# EasyEDA Pro project ProPrj_F080104_2024-08-08.epro

# Schematic Schematic1
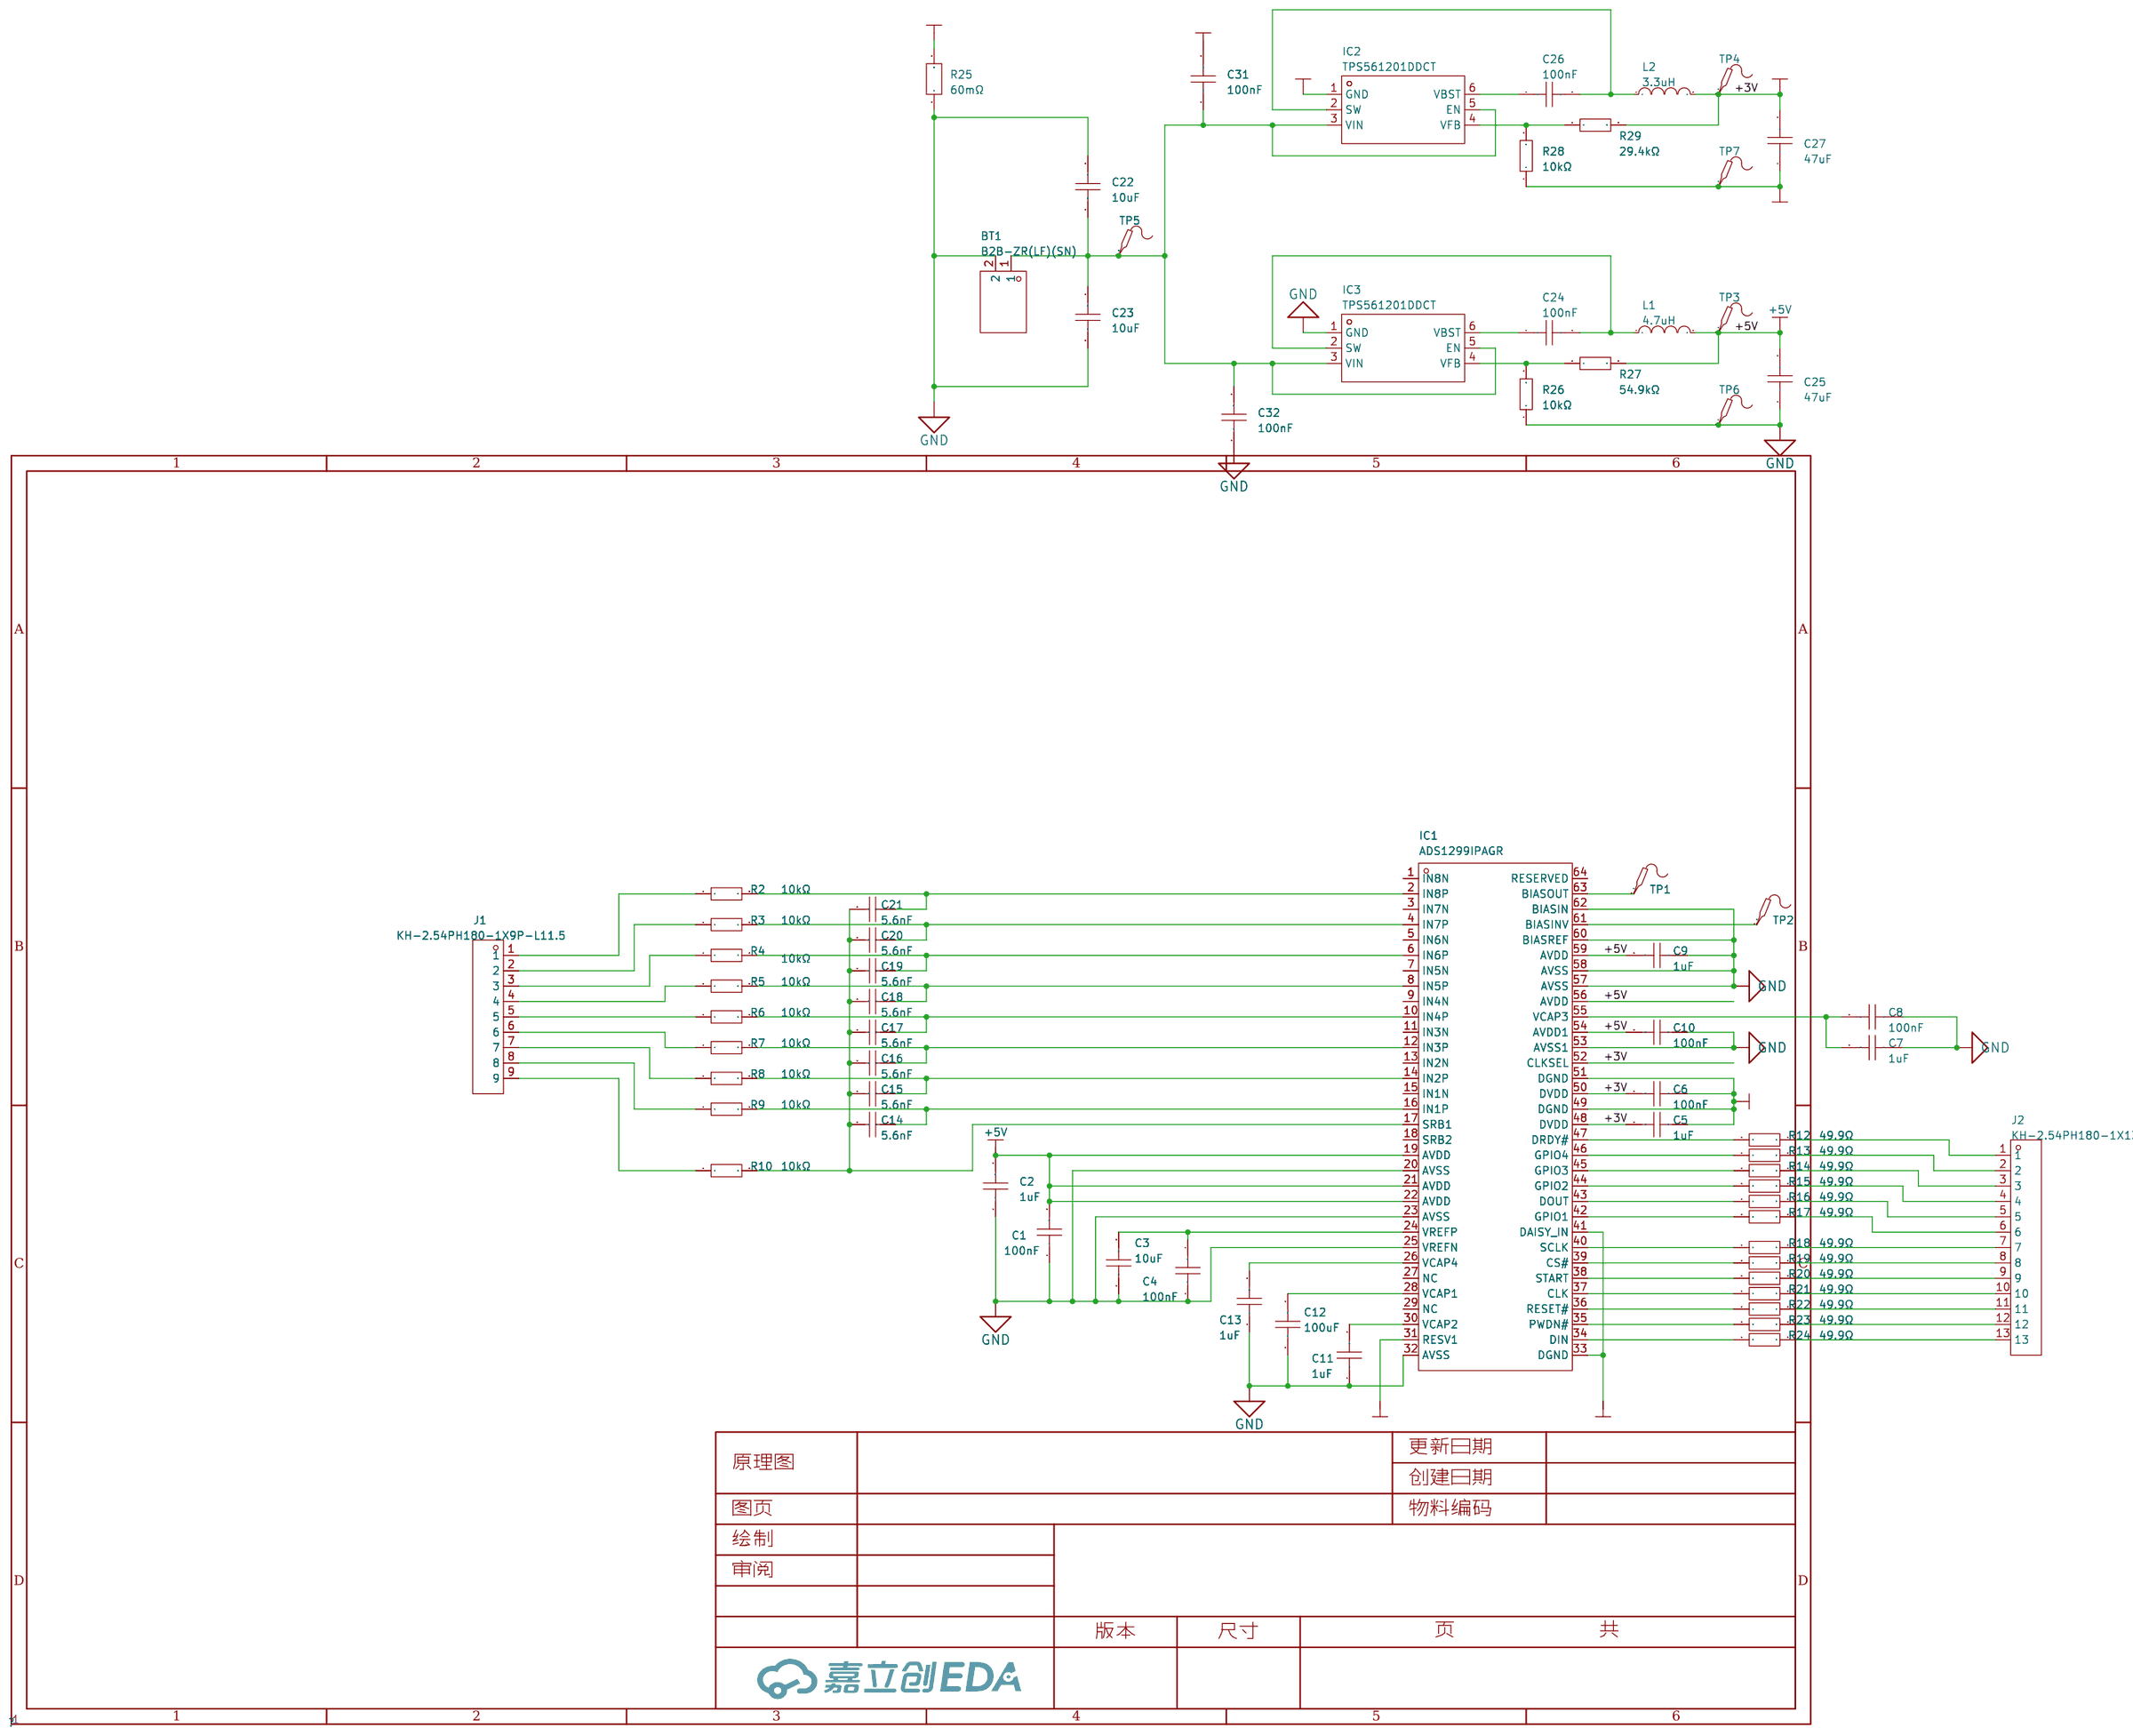
[diagram p0: schematic sheet]

## Parts
BT1  B2B-ZR(LF)(SN)  [CONN-TH_B2B-ZR-LF-SN]
C1  100nF  [C0603]
C2  1uF  [C0603]
C3  10uF  [C0805]
C4  100nF  [C0603]
C5  1uF  [C0603]
C6  100nF  [C0603]
C7  1uF  [C0603]
C8  100nF  [C0603]
C9  1uF  [C0603]
C10  100nF  [C0603]
C11  1uF  [C0603]
C12  100uF  [C1206]
C13  1uF  [C0603]
C14  5.6nF  [C0603]
C15  5.6nF  [C0603]
C16  5.6nF  [C0603]
C17  5.6nF  [C0603]
C18  5.6nF  [C0603]
C19  5.6nF  [C0603]
C20  5.6nF  [C0603]
C21  5.6nF  [C0603]
C22  10uF  [C0805]
C23  10uF  [C0805]
C24  100nF  [C0603]
C25  47uF  [C0805]
C26  100nF  [C0603]
C27  47uF  [C0805]
C31  100nF  [C0603]
C32  100nF  [C0603]
IC1  ADS1299IPAGR  [TQFP-64_L10.0-W10.0-P0.50-LS12.0-TL]
IC2  TPS561201DDCT  [SOT-23-6_L2.9-W1.6-P0.95-LS2.8-BR]
IC3  TPS561201DDCT  [SOT-23-6_L2.9-W1.6-P0.95-LS2.8-BR]
J1  KH-2.54PH180-1X9P-L11.5  [HDR-TH_9P-P2.54-V-M]
J2  KH-2.54PH180-1X13P-L11.5  [HDR-TH_13P-P2.54-V-M]
L1  4.7uH  [IND-SMD_L4.4-W4.2]
L2  3.3uH  [IND-SMD_L4.4-W4.2-A]
R2  10kΩ  [R0603]
R3  10kΩ  [R0603]
R4  10kΩ  [R0603]
R5  10kΩ  [R0603]
R6  10kΩ  [R0603]
R7  10kΩ  [R0603]
R8  10kΩ  [R0603]
R9  10kΩ  [R0603]
R10  10kΩ  [R0603]
R12  49.9Ω  [R0603]
R13  49.9Ω  [R0603]
R14  49.9Ω  [R0603]
R15  49.9Ω  [R0603]
R16  49.9Ω  [R0603]
R17  49.9Ω  [R0603]
R18  49.9Ω  [R0603]
R19  49.9Ω  [R0603]
R20  49.9Ω  [R0603]
R21  49.9Ω  [R0603]
R22  49.9Ω  [R0603]
R23  49.9Ω  [R0603]
R24  49.9Ω  [R0603]
R25  60mΩ  [R2512]
R26  10kΩ  [R0603]
R27  54.9kΩ  [R0603]
R28  10kΩ  [R0603]
R29  29.4kΩ  [R0603]
TP1  -  [Test-Point-0.5mm]
TP2  -  [Test-Point-0.5mm]
TP3  -  [Test-Point-0.5mm]
TP4  -  [Test-Point-0.5mm]
TP5  -  [Test-Point-0.5mm]
TP6  -  [Test-Point-0.5mm]
TP7  -  [Test-Point-0.5mm]

## Library data of the parts
BT1 = B2B-ZR(LF)(SN): 插针结构:1x2P;间距:1.5mm;安装方式:直插;参考系列:ZH;总PIN数:2P;排数:1;每排PIN数:2;行距:-;额定电流:1A;触头材质:黄铜;触头镀层:锡;工作温度范围:-25℃~+85℃;; LCSC Part Name: 1x2P 间距:1.5mm 直插 系列:ZH; Supplier Part: C158011; Manufacturer: JST; Supplier Footprint: 插件,P=1.5mm; JLCPCB Part Class: 扩展库; Datasheet: https://atta.szlcsc.com/upload/public/pdf/source/20181223/C158011_6CFD0C70F58E1854900B8AF425FE5444.pdf; Supplier: LCSC; Pins Structure: 1x2P; Pitch: 1.5mm; Mounting Style: 直插; Reference Series: ZH; Number of Pins: 2P; Number of Rows: 1; Number of PINs Per Row: 2; Current Rating (Max): 1A; Contact Material: 黄铜; Contact Plating: 锡; Operating Temperature Range: -25℃~+85℃; Rated Voltage (Max): 50V; Plastic Material: 玻纤增强PA66; Flame Retardant Rating: UL94V-0; Colour: 白色; Z-Height of the Board: 4.5mm; X-Length of Bottom Edge on Board (Spacing Line): 4.5mm; Y-Width of Bottom Edge on Board: 3.5mm
C1 C4 C6 C8 C10 C24 C26 C31 C32 = CC0603KRX7R9BB104: 容值:100nF;精度:±10%;额定电压:50V;材质(温度系数):X7R;; LCSC Part Name: 100nF ±10% 50V; Supplier Part: C14663; Manufacturer: YAGEO(国巨); Supplier Footprint: 0603; JLCPCB Part Class: 基础库; Datasheet: https://atta.szlcsc.com/upload/public/pdf/source/20180910/C282072_33301C7F631E79921B82A8DAC6BCC5B3.pdf; Supplier: LCSC; Tolerance: ±10%; Voltage Rated: 50V; Temperature Coefficient: X7R
C2 C5 C7 C9 C11 C13 = CL10A105KB8NNNC: 容值:1uF;精度:±10%;额定电压:50V;材质(温度系数):X5R;; LCSC Part Name: 1uF ±10% 50V; Supplier Part: C15849; Manufacturer: SAMSUNG(三星); Supplier Footprint: 0603; JLCPCB Part Class: 基础库; Datasheet: https://atta.szlcsc.com/upload/public/pdf/source/20160218/1457707763339.pdf; Supplier: LCSC; Tolerance: ±10%; Voltage Rated: 50V; Temperature Coefficient: X5R
C3 C22 C23 = CL21A106KAYNNNE_C15850: 容值:10uF;精度:±10%;额定电压:25V;材质(温度系数):X5R;; LCSC Part Name: 10uF ±10% 25V; Supplier Part: C15850; Manufacturer: SAMSUNG(三星); Manufacturer Part: CL21A106KAYNNNE; Supplier Footprint: 0805; JLCPCB Part Class: 基础库; Datasheet: https://atta.szlcsc.com/upload/public/pdf/source/20160218/1457707763339.pdf; Supplier: LCSC; Tolerance: ±10%; Voltage Rated: 25V; Temperature Coefficient: X5R
C12 = GRM31CR61A107ME05L: 容值:100uF;精度:±20%;额定电压:10V;材质(温度系数):X5R;; LCSC Part Name: 100uF ±20% 10V; Supplier Part: C312983; Manufacturer: muRata(村田); Supplier Footprint: 1206; JLCPCB Part Class: 扩展库; Datasheet: https://atta.szlcsc.com/upload/public/pdf/source/20181029/C312983_F99DFC7E8AF2C04CC95A01A8A93C8DA6.pdf; Supplier: LCSC; Tolerance: ±20%; Voltage Rated: 10V; Temperature Coefficient: X5R
C14-C21 = CC0603KRX7R9BB562: 容值:5.6nF;精度:±10%;额定电压:50V;材质(温度系数):X7R;; LCSC Part Name: 5.6nF ±10% 50V; Supplier Part: C107095; Manufacturer: YAGEO(国巨); Supplier Footprint: 0603; JLCPCB Part Class: Extended Part; Datasheet: https://atta.szlcsc.com/upload/public/pdf/source/20180910/C282072_33301C7F631E79921B82A8DAC6BCC5B3.pdf; Supplier: LCSC; Tolerance: ±10%; Voltage Rated: 50V; Temperature Coefficient: X7R
C25 C27 = GRM21BR61A476ME15L: 容值:47uF;精度:±20%;额定电压:10V;材质(温度系数):X5R;; LCSC Part Name: 47uF ±20% 10V; Supplier Part: C124129; Manufacturer: muRata(村田); Supplier Footprint: 0805; JLCPCB Part Class: 扩展库; Datasheet: https://atta.szlcsc.com/upload/public/pdf/source/20190505/C124129_B8538B07430F41D0B450AD3CB0CEE103.pdf; Supplier: LCSC; Tolerance: ±20%; Voltage Rated: 10V; Temperature Coefficient: X5R
IC1 = ADS1299IPAGR: 电源电压:5V；1.8V~3.6V;; Supplier Part: C476817; Manufacturer: TI(德州仪器); Supplier Footprint: TQFP-64(10x10); JLCPCB Part Class: 扩展库; Datasheet: https://www.ti.com/cn/lit/gpn/ads1299; Supplier: LCSC; Supply Voltage: 5V；1.8V~3.6V
IC2 IC3 = TPS561201DDCT: 功能类型:降压型;输出类型:可调;输入电压:4.5V~17V;输出电压:760mV~7V;输出电流(最大值):1A;; Supplier Part: C133965; Manufacturer: TI(德州仪器); Supplier Footprint: SOT-23-6; JLCPCB Part Class: 扩展库; Datasheet: https://www.ti.com/cn/lit/gpn/tps561201; Supplier: LCSC; Function: 降压型; Output Type: 可调; Input Voltage: 4.5V~17V; Output Voltage: 760mV~7V; Output Current (Max): 1A; Switching Frequency: 580kHz; Operating Temperature: -40℃~+85℃@(TA); Synchronous Rectification: 是; Number of Outputs: 1; Topology: 降压式; Switch tube (built-in/external): 内置
J1 = KH-2.54PH180-1X9P-L11.5: 插针结构:1x9P;间距:2.54mm;行距:-;圆针/方针:方针;安装类型:直插;排数:单排;总PIN位数:9P;额定电流:3A;额定电压:-;配合针长度:6mm;塑高:2.5mm;端接针长度:3mm;工作温度范围:-40℃~+105℃;颜色:黑色;; LCSC Part Name: 间距:2.54mm 1x9P 直插 方针; Supplier Part: C2932701; Manufacturer: kinghelm(金航标); Supplier Footprint: 插件,P=2.54mm; JLCPCB Part Class: 扩展库; Datasheet: https://atta.szlcsc.com/upload/public/pdf/source/20211220/F957F65180C658B5F5CB9573E63AB667.pdf; Supplier: LCSC; Pin Structure: 1x9P; Pitch: 2.54mm; Circluar Pins/Square Pins: 方针; Mounting Type: 直插; Number of Rows: 单排; Number of Pins: 9P; Current Rating (Max): 3A; Length of Mating Pin: 6mm; Insulation Height: 2.5mm; Length of End Connection Pin: 3mm; Operating Temperature Range: -40℃~+105℃; Color: 黑色
J2 = KH-2.54PH180-1X13P-L11.5: 插针结构:1x13P;间距:2.54mm;行距:-;圆针/方针:方针;安装类型:直插;排数:单排;总PIN位数:13P;额定电流:3A;额定电压:-;配合针长度:6mm;塑高:2.5mm;端接针长度:3mm;工作温度范围:-40℃~+105℃;颜色:黑色;; LCSC Part Name: 间距:2.54mm 1x13P 直插 方针; Supplier Part: C2932703; Manufacturer: kinghelm(金航标); Supplier Footprint: 插件,P=2.54mm; JLCPCB Part Class: 扩展库; Datasheet: https://atta.szlcsc.com/upload/public/pdf/source/20211220/1D630C15EFD28F2B017872C11B9B32F4.pdf; Supplier: LCSC; Pin Structure: 1x13P; Pitch: 2.54mm; Circluar Pins/Square Pins: 方针; Mounting Type: 直插; Number of Rows: 单排; Number of Pins: 13P; Current Rating (Max): 3A; Length of Mating Pin: 6mm; Insulation Height: 2.5mm; Length of End Connection Pin: 3mm; Operating Temperature Range: -40℃~+105℃; Color: 黑色
L1 = FXL0420-4R7-M: 电感值:4.7uH;精度:±20%;额定电流:2.8A;饱和电流(Isat):3A;类型:一体成型电感;; LCSC Part Name: 4.7uH ±20% 3A; Supplier Part: C167208; Manufacturer: cjiang(长江微电); Supplier Footprint: SMD,4.2x4.4mm; JLCPCB Part Class: 扩展库; Datasheet: https://atta.szlcsc.com/upload/public/pdf/source/20240426/3189EA8206330E2108542F9E34E540E7.pdf; Supplier: LCSC; Tolerance: ±20%; Rated Current: 2.8A; Saturation Current (Isat): 3A; DC Resistance (DCR): 105mΩ; Type: 一体成型电感
L2 = FXL0420-3R3-M: 电感值:3.3uH;精度:±20%;额定电流:3.3A;饱和电流(Isat):4A;类型:一体成型电感;; LCSC Part Name: 3.3uH ±20% 4A; Supplier Part: C167207; Manufacturer: cjiang(长江微电); Supplier Footprint: SMD,4.2x4.4mm; JLCPCB Part Class: 扩展库; Datasheet: https://atta.szlcsc.com/upload/public/pdf/source/20240426/3189EA8206330E2108542F9E34E540E7.pdf; Supplier: LCSC; Tolerance: ±20%; Rated Current: 3.3A; Saturation Current (Isat): 4A; DC Resistance (DCR): 87mΩ; Type: 一体成型电感
R2-R10 R26 R28 = 0603WAF1002T5E: 电阻类型:厚膜电阻;阻值:10kΩ;精度:±1%;功率:100mW;最大工作电压:75V;温度系数:±100ppm/℃;; LCSC Part Name: 厚膜电阻 10kΩ ±1% 100mW; Supplier Part: C25804; Manufacturer: UNI-ROYAL(厚声); Supplier Footprint: 0603; JLCPCB Part Class: 基础库; Datasheet: https://atta.szlcsc.com/upload/public/pdf/source/20200306/C422600_1E6D84923E4A46A82E41ADD87F860B5C.pdf; Supplier: LCSC; Type: 厚膜电阻; Tolerance: ±1%; Power(Watts): 100mW; Overload Voltage (Max): 75V; Temperature Coefficient: ±100ppm/℃; Operating Temperature Range: -55℃~+155℃
R12-R24 = 0603WAF499JT5E: 电阻类型:厚膜电阻;阻值:49.9Ω;精度:±1%;功率:100mW;最大工作电压:75V;温度系数:±100ppm/℃;; LCSC Part Name: 49.9Ω ±1% 100mW 厚膜电阻; Supplier Part: C23185; Manufacturer: UNI-ROYAL(厚声); Supplier Footprint: 0603; JLCPCB Part Class: Basic Part; Datasheet: https://atta.szlcsc.com/upload/public/pdf/source/20200306/C422600_1E6D84923E4A46A82E41ADD87F860B5C.pdf; Supplier: LCSC; Type: 厚膜电阻; Tolerance: ±1%; Power(Watts): 100mW; Overload Voltage (Max): 75V; Temperature Coefficient: ±100ppm/℃; Operating Temperature Range: -55℃~+155℃
R25 = 25121WF600MT4E: 电阻类型:厚膜电阻;阻值:60mΩ;精度:±1%;功率:1W;最大工作电压:200V;温度系数:±800ppm/℃;; LCSC Part Name: 60mΩ ±1% 1W 厚膜电阻; Supplier Part: C421528; Manufacturer: UNI-ROYAL(厚声); Supplier Footprint: 2512; JLCPCB Part Class: 扩展库; Datasheet: https://atta.szlcsc.com/upload/public/pdf/source/20200306/C422600_1E6D84923E4A46A82E41ADD87F860B5C.pdf; Supplier: LCSC; Type: 厚膜电阻; Tolerance: ±1%; Power(Watts): 1W; Overload Voltage (Max): 200V; Temperature Coefficient: ±800ppm/℃; Operating Temperature Range: -55℃~+155℃
R27 = 0603WAF5492T5E: 电阻类型:厚膜电阻;阻值:54.9kΩ;精度:±1%;功率:100mW;最大工作电压:75V;温度系数:±100ppm/℃;; LCSC Part Name: 54.9kΩ ±1% 100mW 厚膜电阻; Supplier Part: C23077; Manufacturer: UNI-ROYAL(厚声); Supplier Footprint: 0603; JLCPCB Part Class: 扩展库; Datasheet: https://atta.szlcsc.com/upload/public/pdf/source/20200306/C422600_1E6D84923E4A46A82E41ADD87F860B5C.pdf; Supplier: LCSC; Type: 厚膜电阻; Tolerance: ±1%; Power(Watts): 100mW; Overload Voltage (Max): 75V; Temperature Coefficient: ±100ppm/℃; Operating Temperature Range: -55℃~+155℃
R29 = 0603WAF2942T5E: 电阻类型:厚膜电阻;阻值:29.4kΩ;精度:±1%;功率:100mW;最大工作电压:75V;温度系数:±100ppm/℃;; LCSC Part Name: 29.4kΩ ±1% 100mW 厚膜电阻; Supplier Part: C22974; Manufacturer: UNI-ROYAL(厚声); Supplier Footprint: 0603; JLCPCB Part Class: 扩展库; Datasheet: https://atta.szlcsc.com/upload/public/pdf/source/20200306/C422600_1E6D84923E4A46A82E41ADD87F860B5C.pdf; Supplier: LCSC; Type: 厚膜电阻; Tolerance: ±1%; Power(Watts): 100mW; Overload Voltage (Max): 75V; Temperature Coefficient: ±100ppm/℃; Operating Temperature Range: -55℃~+155℃
TP1-TP7 = Test-Point: Test Point 测试点

## Nets
+3V: C5.2 C6.2 C27.2 IC1.48(DVDD) IC1.50(DVDD) IC1.52(CLKSEL) L2.2 R29.2 TP4.1
+5V: C1.2 C2.2 C9.2 C10.2 C25.2 IC1.19(AVDD) IC1.21(AVDD) IC1.22(AVDD) IC1.54(AVDD1) IC1.56(AVDD) IC1.59(AVDD) L1.2 R27.2 TP3.1
GND: BT1.2 C1.1 C2.1 C3.1 C4.2 C7.1 C8.1 C9.1 C10.1 C11.1 C12.2 C13.1 C22.2 C23.2 C25.1 C32.1 IC1.20(AVSS) IC1.23(AVSS) IC1.25(VREFN) IC1.32(AVSS) IC1.53(AVSS1) IC1.57(AVSS) IC1.58(AVSS) IC1.60(BIASREF) IC1.62(BIASIN) IC3.1(GND) R25.1 R26.1 TP6.1
GNDD: C5.1 C6.1 C27.1 C31.2 IC1.31(RESV1) IC1.33(DGND) IC1.41(DAISY_IN) IC1.49(DGND) IC1.51(DGND) IC2.1(GND) R25.2 R28.1 TP7.1
$1N2055: C21.1 IC1.2(IN8P) R2.2
$1N2059: C20.1 IC1.4(IN7P) R3.2
$1N2064: C19.1 IC1.6(IN6P) R4.2
$1N2069: C18.1 IC1.8(IN5P) R5.2
$1N2074: C17.1 IC1.10(IN4P) R6.2
$1N2079: C16.1 IC1.12(IN3P) R7.2
$1N2084: C15.1 IC1.14(IN2P) R8.2
$1N2089: C14.1 IC1.16(IN1P) R9.2
$1N2097: C14.2 C15.2 C16.2 C17.2 C18.2 C19.2 C20.2 C21.2 IC1.17(SRB1) R10.2
$1N2947: BT1.1 C22.1 C23.1 C31.1 C32.2 IC2.3(VIN) IC2.5(EN) IC3.3(VIN) IC3.5(EN) TP5.1
$1N3234: C26.2 IC2.2(SW) L2.1
$1N3242: C26.1 IC2.6(VBST)
$1N3333: C24.2 IC3.2(SW) L1.1
$1N3336: C24.1 IC3.6(VBST)
$1N3595: IC2.4(VFB) R28.2 R29.1
$1N4010: IC3.4(VFB) R26.2 R27.1
$1N4304: J1.1 R2.1
$1N4313: J1.2 R3.1
$1N4321: J1.3 R4.1
$1N4328: J1.4 R5.1
$1N4338: J1.5 R6.1
$1N4345: J1.6 R7.1
$1N4350: J1.7 R8.1
$1N4357: J1.8 R9.1
$1N4364: J1.9 R10.1
$1N4747: C3.2 C4.1 IC1.24(VREFP)
$1N5094: C11.2 IC1.30(VCAP2)
$1N5099: C12.1 IC1.28(VCAP1)
$1N5104: C13.2 IC1.26(VCAP4)
$1N5770: IC1.47(DRDY#) R12.1
$1N5774: IC1.46(GPIO4) R13.1
$1N5779: IC1.45(GPIO3) R14.1
$1N5784: IC1.44(GPIO2) R15.1
$1N5789: IC1.43(DOUT) R16.1
$1N5794: IC1.42(GPIO1) R17.1
$1N5799: IC1.40(SCLK) R18.1
$1N5804: IC1.39(CS#) R19.1
$1N5809: IC1.38(START) R20.1
$1N5814: IC1.37(CLK) R21.1
$1N5819: IC1.36(RESET#) R22.1
$1N5824: IC1.35(PWDN#) R23.1
$1N5829: IC1.34(DIN) R24.1
$1N6093: J2.13 R24.2
$1N6097: J2.12 R23.2
$1N6102: J2.11 R22.2
$1N6107: J2.10 R21.2
$1N6112: J2.9 R20.2
$1N6117: J2.8 R19.2
$1N6122: J2.7 R18.2
$1N6127: J2.6 R17.2
$1N6137: J2.5 R16.2
$1N6143: J2.4 R15.2
$1N6150: J2.3 R14.2
$1N6157: J2.2 R13.2
$1N6164: J2.1 R12.2
$1N6494: C7.2 C8.2 IC1.55(VCAP3)
$1N9345: IC1.63(BIASOUT) TP1.1
$1N9349: IC1.61(BIASINV) TP2.1

Not connected (* = marked no-connect by the designer): IC1 1(IN8N) 3(IN7N) 5(IN6N) 7(IN5N) 9(IN4N) 11(IN3N) 13(IN2N) 15(IN1N) 18(SRB2) 27(NC) 29(NC) 64(RESERVED)

# Board PCB1
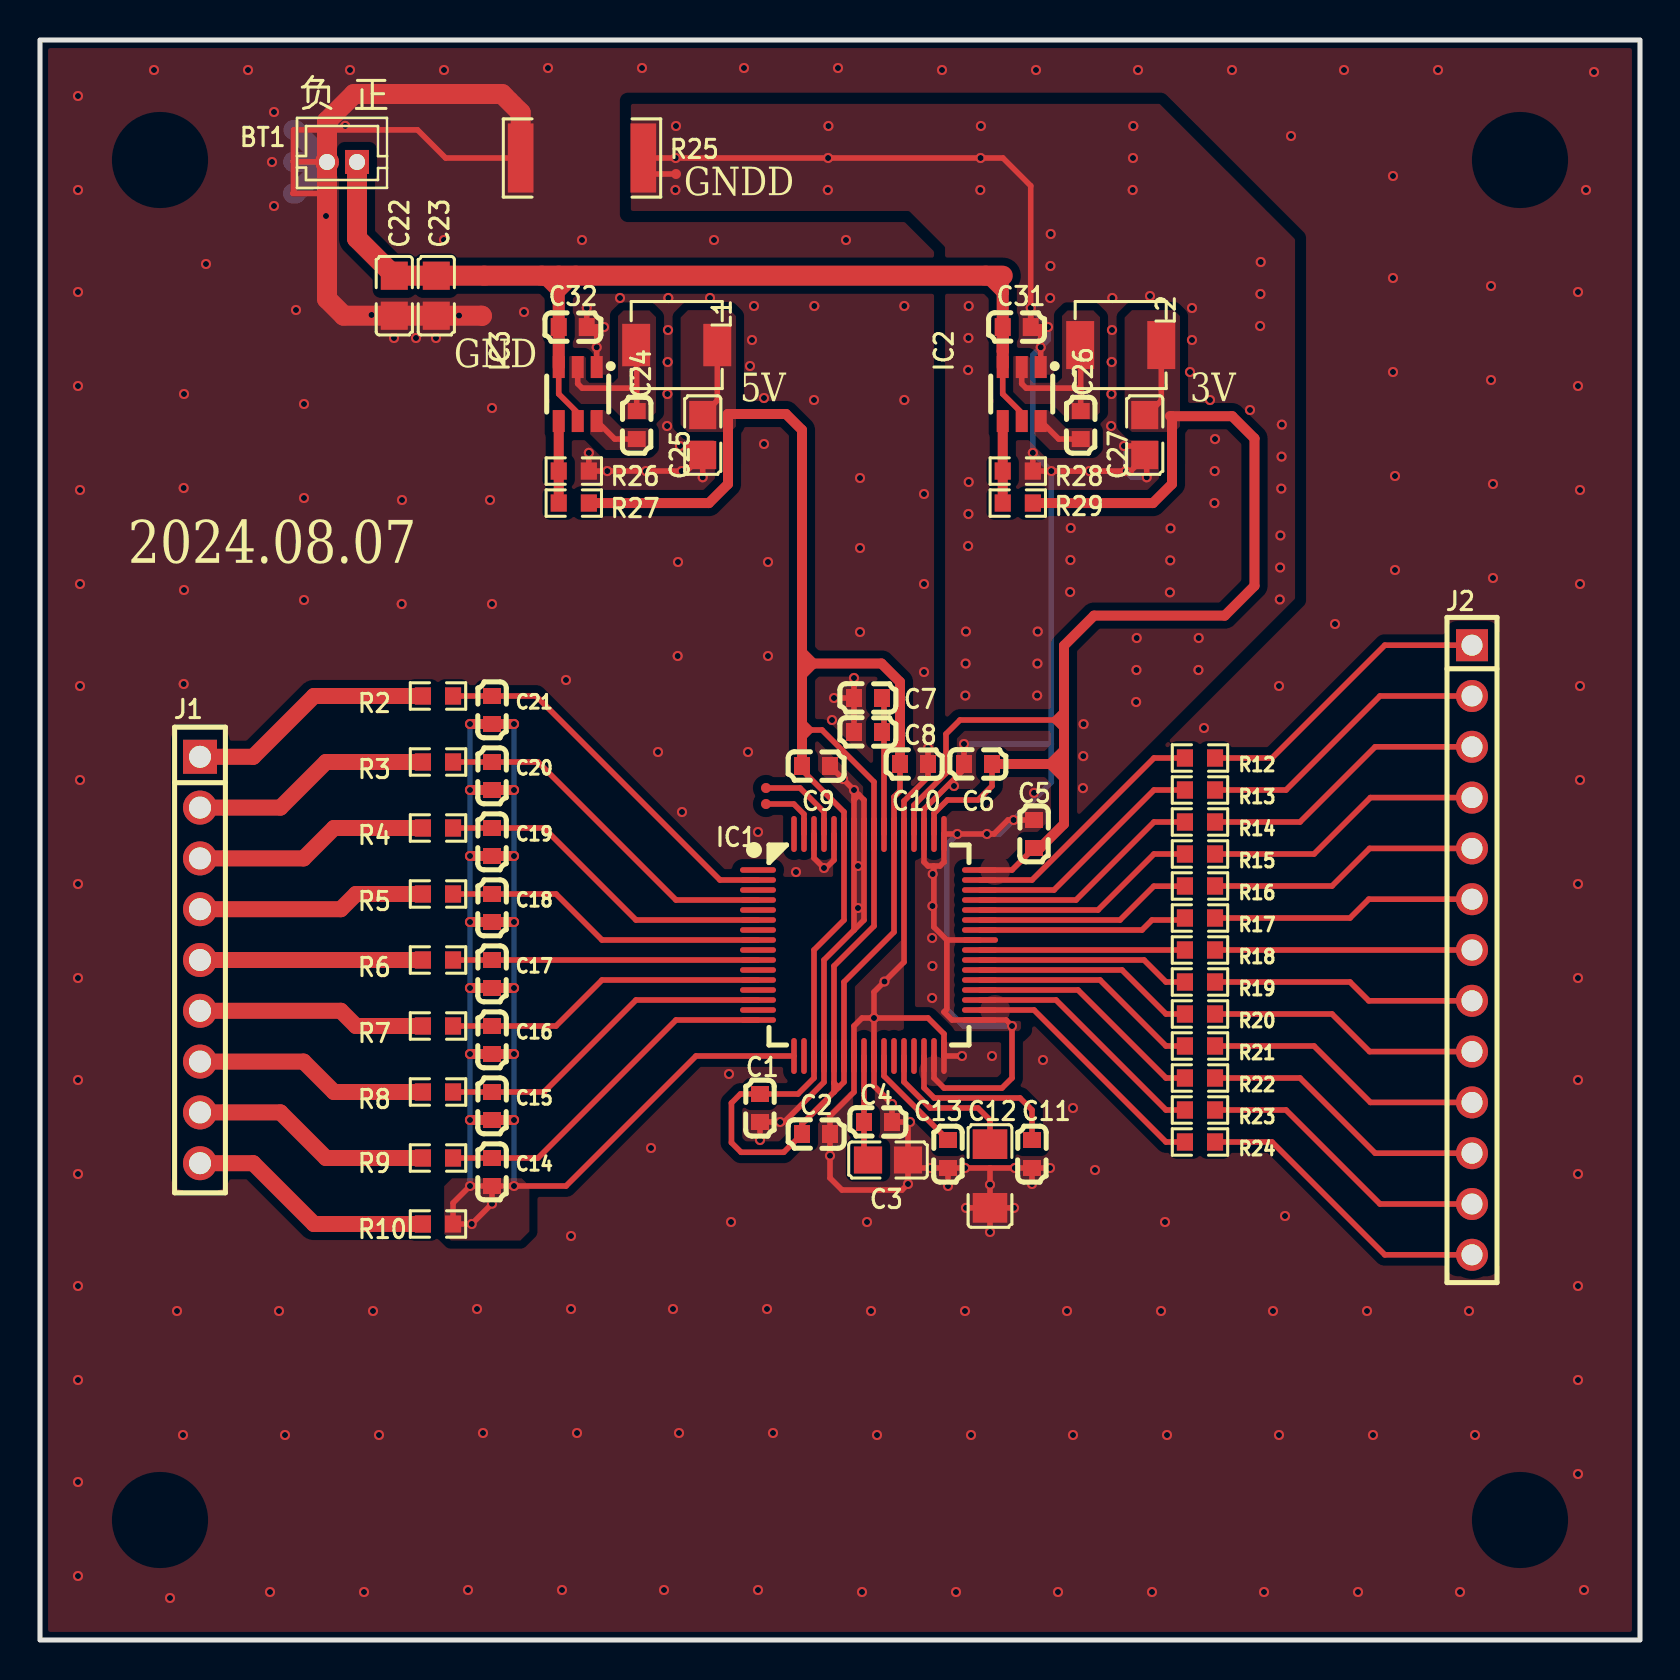
[diagram p1: board, top side]
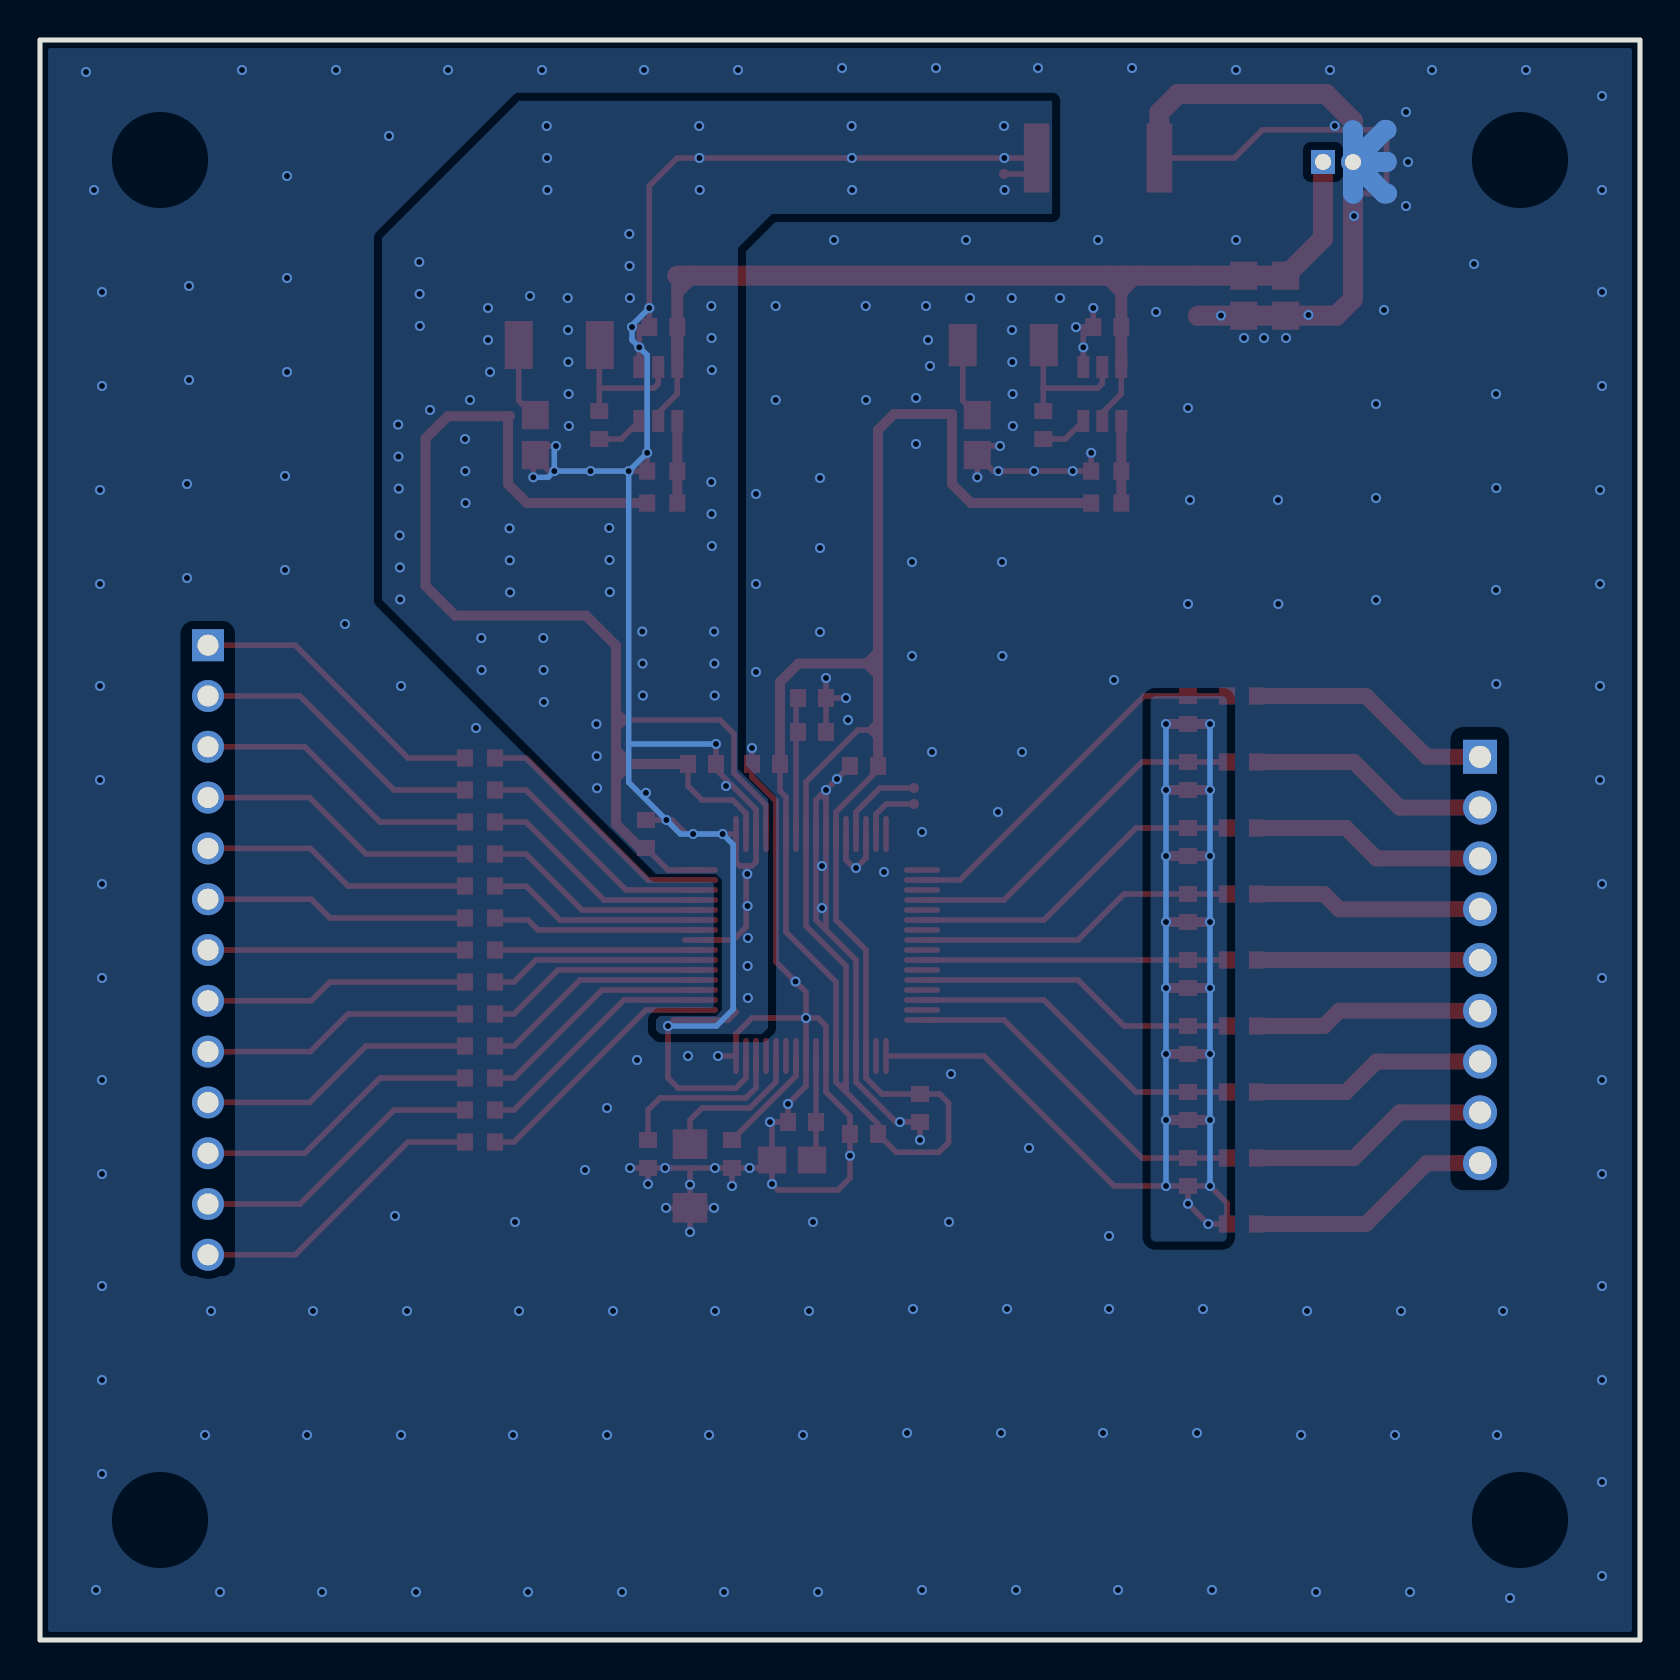
[diagram p2: board, bottom side, seen from below]

Outline 80 x 80 mm; copper layers: Top Layer, Bottom Layer. Coordinates in mm from the lower left corner of the outline.
Outline path: rectangle 0,80 80,0
Stack: Top Layer 0.035mm / Dielectric1 1.51mm FR4 er 4.5 / Bottom Layer 0.035mm

## Design rules (mm)
template: 自定义配置
spacing copperThickness1oz (default): track to track 0.218, other pairs 0.218 to 0.218
spacing copperThickness2oz: track to track 0.203, other pairs 0.152 to 0.3
track width copperThickness1oz (default): min 0.127, default 0.279, max 2.54
track width copperThickness2oz: min 0.203, default 0.254, max 2.54
differential pair differentialPair (default): width min 0.127, default 0.254, max 2.54; gap min 0.152, default 0.152
via viaSize (default): diameter min 0.5, default 0.61, max 10; hole min 0.3, default 0.305, max 6.299

## Placement (name value [footprint] x y rotation side)
BT1  B2B-ZR(LF)(SN)  [CONN-TH_B2B-ZR-LF-SN]  15.1 73.9 0 top
C1  100nF  [C0603]  36 26.6 90 top
C2  1uF  [C0603]  38.8 25.3 180 top
C3  10uF  [C0805]  42.4 24 180 top
C4  100nF  [C0603]  41.9 25.9 0 top
C5  1uF  [C0603]  49.7 40.3 270 top
C6  100nF  [C0603]  46.9 43.8 0 top
C7  1uF  [C0603]  41.4 47.1 0 top
C8  100nF  [C0603]  41.4 45.4 0 top
C9  1uF  [C0603]  38.8 43.7 180 top
C10  100nF  [C0603]  43.7 43.8 180 top
C11  1uF  [C0603]  49.6 24.3 90 top
C12  100uF  [C1206]  47.5 23.2 270 top
C13  1uF  [C0603]  45.4 24.3 90 top
C14  5.6nF  [C0603]  22.6 23.4 270 top
C15  5.6nF  [C0603]  22.6 26.7 270 top
C16  5.6nF  [C0603]  22.6 30 270 top
C17  5.6nF  [C0603]  22.6 33.3 270 top
C18  5.6nF  [C0603]  22.6 36.6 270 top
C19  5.6nF  [C0603]  22.6 39.9 270 top
C20  5.6nF  [C0603]  22.6 43.2 270 top
C21  5.6nF  [C0603]  22.6 46.5 270 top
C22  10uF  [C0805]  17.72 67.22 270 top
C23  10uF  [C0805]  19.81 67.22 270 top
C24  100nF  [C0603]  29.84 60.75 90 top
C25  47uF  [C0805]  33.14 60.25 90 top
C26  100nF  [C0603]  52.04 60.75 90 top
C27  47uF  [C0805]  55.24 60.25 90 top
C31  100nF  [C0603]  48.84 65.65 0 top
C32  100nF  [C0603]  26.64 65.65 180 top
IC1  ADS1299IPAGR  [TQFP-64_L10.0-W10.0-P0.50-LS12.0-TL]  41.45 34.75 0 top
IC2  TPS561201DDCT  [SOT-23-6_L2.9-W1.6-P0.95-LS2.8-BR]  49.09 62.3 90 top
IC3  TPS561201DDCT  [SOT-23-6_L2.9-W1.6-P0.95-LS2.8-BR]  26.89 62.3 90 top
J1  KH-2.54PH180-1X9P-L11.5  [HDR-TH_9P-P2.54-V-M]  8 34 270 top
J2  KH-2.54PH180-1X13P-L11.5  [HDR-TH_13P-P2.54-V-M]  71.6 34.5 270 top
L1  4.7uH  [IND-SMD_L4.4-W4.2]  31.84 64.75 180 top
L2  3.3uH  [IND-SMD_L4.4-W4.2-A]  54.04 64.75 180 top
R2  10kΩ  [R0603]  19.9 47.2 0 top
R3  10kΩ  [R0603]  19.9 43.9 0 top
R4  10kΩ  [R0603]  19.9 40.6 0 top
R5  10kΩ  [R0603]  19.9 37.3 0 top
R6  10kΩ  [R0603]  19.9 34 0 top
R7  10kΩ  [R0603]  19.9 30.7 0 top
R8  10kΩ  [R0603]  19.9 27.4 0 top
R9  10kΩ  [R0603]  19.9 24.1 0 top
R10  10kΩ  [R0603]  19.9 20.8 0 top
R12  49.9Ω  [R0603]  58 44.1 0 top
R13  49.9Ω  [R0603]  58 42.5 0 top
R14  49.9Ω  [R0603]  58 40.9 0 top
R15  49.9Ω  [R0603]  58 39.3 0 top
R16  49.9Ω  [R0603]  58 37.7 0 top
R17  49.9Ω  [R0603]  58 36.1 0 top
R18  49.9Ω  [R0603]  58 34.5 0 top
R19  49.9Ω  [R0603]  58 32.9 0 top
R20  49.9Ω  [R0603]  58 31.3 0 top
R21  49.9Ω  [R0603]  58 29.7 0 top
R22  49.9Ω  [R0603]  58 28.1 0 top
R23  49.9Ω  [R0603]  58 26.5 0 top
R24  49.9Ω  [R0603]  58 24.9 0 top
R25  60mΩ  [R2512]  27.1 74.1 0 top
R26  10kΩ  [R0603]  26.69 58.45 180 top
R27  54.9kΩ  [R0603]  26.69 56.85 0 top
R28  10kΩ  [R0603]  48.89 58.45 180 top
R29  29.4kΩ  [R0603]  48.89 56.85 0 top
TP1  -  [Test-Point-0.5mm]  36.3 41.8 0 top
TP2  -  [Test-Point-0.5mm]  36.3 42.6 0 top
TP3  -  [Test-Point-0.5mm]  34.4 61.3 0 top
TP4  -  [Test-Point-0.5mm]  56.5 61.2 0 top
TP5  -  [Test-Point-0.5mm]  22.22 68.22 90 top
TP6  -  [Test-Point-0.5mm]  22.1 66.2 90 top
TP7  -  [Test-Point-0.5mm]  31.8 73.3 0 top

## Footprints (pads in the part's own frame, mm; a bottom-side part is the same pattern mirrored in y, then rotated)
C0603
  rect 0.8x0.9 smd: 1(-0.7,0) 2(0.7,0)
C0805
  rect 1.41x1.35 smd: 1(-1,0) 2(1,0)
C1206
  rect 1.485x1.728 smd: 1(-1.593,0) 2(1.593,0)
CONN-TH_B2B-ZR-LF-SN
  rect 1.2x1.2 hole 0.8: 1(0.75,0.001)
  round 1.2 hole 0.8: 2(-0.75,-0.001)
HDR-TH_9P-P2.54-V-M
  rect 1.7x1.7 hole 1.1: 1(-10.16,0)
  round 1.7 hole 1.1: 2(-7.62,0) 3(-5.08,0) 4(-2.54,0) 5(0,0) 6(2.54,0) 7(5.08,0) 8(7.62,0) 9(10.16,0)
HDR-TH_13P-P2.54-V-M
  rect 1.6x1.6 hole 1.05: 1(-15.24,0)
  round 1.6 hole 1.05: 2(-12.7,0) 3(-10.16,0) 4(-7.62,0) 5(-5.08,0) 6(-2.54,0) 7(0,0) 8(2.54,0) 9(5.08,0) 10(7.62,0) 11(10.16,0) 12(12.7,0) 13(15.24,0)
IND-SMD_L4.4-W4.2
  rect 1.4x2.12 smd: 1(2.028,0) 2(-2.028,0)
IND-SMD_L4.4-W4.2-A
  rect 1.4x2.4 smd: 1(2.028,0) 2(-2.028,0)
R0603
  rect 0.806x0.864 smd: 1(-0.753,0) 2(0.753,0)
R2512
  rect 1.282x3.456 smd: 1(-3.067,0) 2(3.067,0)
SOT-23-6_L2.9-W1.6-P0.95-LS2.8-BR
  rect 1.1x0.6 smd: 1(1.35,-0.95) 2(1.35,0) 3(1.35,0.95) 4(-1.35,0.95) 5(-1.35,0) 6(-1.35,-0.95)
Test-Point-0.5mm
  round 0.5 smd: 1(0,0)
TQFP-64_L10.0-W10.0-P0.50-LS12.0-TL
  oval 1.8x0.28 smd: 1(-5.55,3.75) 2(-5.55,3.25) 3(-5.55,2.75) 4(-5.55,2.25) 5(-5.55,1.75) 6(-5.55,1.25) 7(-5.55,0.75) 8(-5.55,0.25) 9(-5.55,-0.25) 10(-5.55,-0.75) 11(-5.55,-1.25) 12(-5.55,-1.75) 13(-5.55,-2.25) 14(-5.55,-2.75) 15(-5.55,-3.25) 16(-5.55,-3.75) 33(5.55,-3.75) 34(5.55,-3.25) 35(5.55,-2.75) 36(5.55,-2.25) 37(5.55,-1.75) 38(5.55,-1.25) 39(5.55,-0.75) 40(5.55,-0.25) 41(5.55,0.25) 42(5.55,0.75) 43(5.55,1.25) 44(5.55,1.75) 45(5.55,2.25) 46(5.55,2.75) 47(5.55,3.25) 48(5.55,3.75)
  oval 0.28x1.8 smd: 17(-3.75,-5.55) 18(-3.25,-5.55) 19(-2.75,-5.55) 20(-2.25,-5.55) 21(-1.75,-5.55) 22(-1.25,-5.55) 23(-0.75,-5.55) 24(-0.25,-5.55) 25(0.25,-5.55) 26(0.75,-5.55) 27(1.25,-5.55) 28(1.75,-5.55) 29(2.25,-5.55) 30(2.75,-5.55) 31(3.25,-5.55) 32(3.75,-5.55) 49(3.75,5.55) 50(3.25,5.55) 51(2.75,5.55) 52(2.25,5.55) 53(1.75,5.55) 54(1.25,5.55) 55(0.75,5.55) 56(0.25,5.55) 57(-0.25,5.55) 58(-0.75,5.55) 59(-1.25,5.55) 60(-1.75,5.55) 61(-2.25,5.55) 62(-2.75,5.55) 63(-3.25,5.55) 64(-3.75,5.55)

## Nets
As in the schematic.

Pads without a net: IC1 1 3 5 7 9 11 13 15 18 27 29 64

## Via types
v1: diameter 0.508, hole 0.305, Top Layer to Bottom Layer, 313 vias

## Routing (per net, layer and track width the routed paths; a pad name or vN(x,y) marks a point on that pad's centre or on a via; arc(x,y) is an arc through that point)
+3V: length 75.8
  Top Layer w0.28: IC1.52 43.7,41.74 45.3,43.34 45.3,45.3 46,46 50.69,46 ; IC1.48 48.6,38.5 C5.2 ; 50.69,46 51.2,45.49 ; 50.69,46 51.2,46.51 ; 50.69,46 51.2,46 ; 55.34,61.25 56.06,61.97 L2.2 ; IC1.50 44.7,41.33 45.37,42 46.9,42 47.6,42.7 C6.2
  Top Layer w0.5: 51.2,43.8 51.2,44.49 ; 51.2,43.8 50.51,43.8 ; 51.2,43.8 51.2,43.11 ; 51.2,44.49 50.51,43.8 ; 51.2,44.49 51.2,49.72 52.7,51.22 59.24,51.22 60.72,52.7 60.72,60.08 59.61,61.19 56.6,61.19 56.6,57.8 55.65,56.85 49.64,56.85 ; C5.2 50,39.6 51.2,40.8 51.2,43.11 ; 50.51,43.8 C6.2 ; 50.51,43.8 51.2,43.11
+5V: length 117.4
  Top Layer w0.28: L1.2 33.86,61.97 C25.2 ; 39.7,27.85 39.7,27.4 ; 39.7,27.85 39.93,27.63 ; 39.7,27.85 IC1.21 39.7,33.7 41.7,35.7 IC1.56 41.7,42.9 39.1,45.5 38.55,45.5 ; 39.7,27.4 38.1,25.8 C2.2 37.19,24.39 35.05,24.39 34.57,24.87 34.57,26.85 35.02,27.3 C1.2 37.9,27.3 38.7,28.1 IC1.19 38.7,34.5 40.2,36 IC1.59 40.2,41.4 38.1,43.5 C9.2 ; 39.7,27.4 39.93,27.63 ; C10.2 43,42.45 42.7,42.15 IC1.54 42.7,35.4 40.2,32.9 IC1.22 40.2,27.9 39.93,27.63 ; 38.55,45.5 38.1,45.95 ; 38.55,45.5 38.1,45.5 ; 38.55,45.5 38.1,45.05
  Top Layer w0.5: 38.1,48.26 38.1,48.82 ; 38.1,48.26 38.66,48.82 ; 38.1,48.26 C9.2 ; 38.1,48.82 38.1,49.38 ; 38.1,48.82 38.66,48.82 ; 38.1,49.38 38.1,60.5 37.3,61.3 TP3.1 34.4,57.8 33.45,56.85 27.44,56.85 ; 38.1,49.38 38.66,48.82 ; 38.66,48.82 42.08,48.82 43,47.9 C10.2
GND: length 168.6
  Top Layer w0.28: C12.2 v1(47.5,22.77) 47.5,23.6 ; C12.2 v1(47.5,20.4) ; C12.2 v1(48.7,21.61) ; C12.2 v1(46.3,21.61) ; C25.1 v1(33.14,58.14) ; C25.1 32.68,59.7 v1(32,59.7) ; C25.1 32.34,58.45 v1(30.29,58.45) v1(28.37,58.45) 27.44,58.45 v1(27.44,59.36) ; v1(44.4,44.6) C10.1 44.4,43.15 43.2,41.95 IC1.53 43.2,33.9 v1(42.22,32.92) 41.7,32.4 v1(41.7,31.1) ; 12.67,73.91 12.67,72.36 12.65,72.33 14.32,72.33 14.33,72.31 ; 12.67,73.91 12.66,73.91 ; 12.67,73.91 14.33,73.91 BT1.2 ; 12.67,73.91 12.67,75.5 18.88,75.5 20.28,74.1 R25.1 ; C23.2 19.8,66.2 17.7,66.2 C22.2 ; v1(46.1,29.2) IC1.32 45.2,30.3 44.4,31.1 v1(41.7,31.1) ; 40.95,42.25 40.7,42.01 ; 40.95,42.25 41.2,42 IC1.57 41.2,36 40.7,35.5 ; 40.95,42.25 v1(40.7,42.5) ; 40.7,42.01 IC1.58 40.7,35.5 ; 40.7,42.01 v1(40.7,42.5) ; 47.5,23.6 v1(48.74,23.6) C11.1 ; 47.5,23.6 v1(46.25,23.6) C13.1 ; v1(41.7,31.1) 41.1,31.1 40.7,30.7 IC1.23 40.7,27.4 39.5,26.2 C2.1 v1(39.5,24.22) 39.5,23.1 40.1,22.5 43.1,22.5 v1(43.4,22.8) C3.1 ; v1(41.7,31.1) IC1.25 41.7,27.7 v1(42.6,26.8) C4.2 43.4,25.9 C3.1 ; IC1.62 38.7,39.1 v1(39.2,38.6) 39.3,38.6 39.7,39 IC1.60 ; 40.7,35.5 39.2,34 IC1.20 39.2,27.89 37.21,25.9 v1(37.01,25.9) C1.1 v1(36,25) ; C11.1 v1(50.5,23.6) ; C11.1 v1(49.6,22.8) ; C3.1 43.8,23.6 v1(44.52,23.6) C13.1 ; 27.84,65.65 C32.1 v1(27.34,66.6) ; 27.84,65.65 v1(28.2,65.65) ; 27.84,65.65 v1(27.84,64.64) 27.84,63.65 ; C9.1 v1(40.15,43.05) v1(40.7,42.5) ; C7.1 v1(40.7,48.1) ; C7.1 v1(39.7,47.1) ; C7.1 C8.1 ; C13.1 v1(45.4,22.7) ; 14.35,75.47 14.36,75.49
  Top Layer w1: R25.1 24.03,76.37 23.1,77.3 15.7,77.3 14.35,75.95 BT1.2 14.35,67.05 15.19,66.22 C22.2 C23.2 22.09,66.22 TP6.1
  Bottom Layer w1: BT1.2 12.67,73.9 12.66,73.91 ; BT1.2 14.35,72.33 14.33,72.31 ; BT1.2 14.35,75.47 14.36,75.49 ; BT1.2 12.74,75.5 12.67,75.5 ; BT1.2 12.78,72.33 12.65,72.33
  vias: v1(1.9,77.2) v1(1.9,72.5) v1(1.9,67.4) v1(1.9,62.7) v1(1.9,37.8) v1(1.9,33.1) v1(1.9,28) v1(1.9,23.3) v1(1.9,17.7) v1(1.9,13) v1(1.9,7.9) v1(1.9,3.2) v1(2,57.5) v1(2,52.8) v1(2,47.7) v1(2,43) v1(5.7,78.5) v1(6.5,2.1) v1(6.85,16.45) v1(7.2,62.3) v1(7.19,57.6) v1(7.2,52.5) v1(7.19,47.8) v1(7.15,10.25) v1(8.3,68.8) v1(10.4,78.5) v1(11.5,2.4) v1(11.6,73.9) v1(11.7,76.4) v1(11.7,71.7) v1(11.95,16.45) v1(12.25,10.25) v1(12.8,66.5) v1(13.2,61.8) v1(13.2,57.1) v1(13.2,52) v1(14.3,71.2) v1(15.26,75.71) v1(15.5,78.5) v1(16.2,2.4) v1(16.58,66.25) v1(16.65,16.45) v1(16.95,10.25) v1(17.7,65.1) v1(18.1,57) v1(18.09,51.8) v1(18.8,65.1) v1(19.8,65.1) v1(20.2,78.5) v1(20.2,70) v1(20.95,66.22) v1(21.4,2.5) v1(21.85,16.55) v1(22.15,10.35) v1(22.5,57) v1(22.6,61.6) v1(22.6,51.8) v1(24.2,66.4) v1(25.4,78.6) v1(26.1,2.5) v1(26.3,48) v1(26.55,20.2) v1(26.55,16.55) v1(26.85,10.35) v1(27.1,70) v1(29,67.1) v1(30.1,78.6) v1(30.55,24.6) v1(30.9,44.4) v1(31.2,2.5) v1(31.41,67.1) v1(31.4,65.5) v1(31.38,63.9) v1(31.37,62.3) v1(31.36,60.7) v1(31.65,16.55) v1(31.9,53.9) v1(31.88,49.2) v1(31.95,10.35) v1(32.09,58.45) v1(32.1,41.4) v1(33.5,67.1) v1(33.7,70) v1(34.45,28.3) v1(34.55,20.9) v1(35.2,78.6) v1(35.4,44.4) v1(35.5,63.7) v1(35.6,65) v1(35.7,66.7) v1(35.9,40.4) v1(35.9,2.5) v1(36.2,62.1) v1(36.2,59.8) v1(36.35,16.55) v1(36.4,53.9) v1(36.4,49.2) v1(36.65,10.35) v1(37.8,38.4) v1(38.72,66.7) v1(38.7,62) v1(39.6,46) v1(39.9,78.6) v1(40.3,70) v1(40.9,38.7) v1(40.9,36.6) v1(41,58.1) v1(41,54.6) v1(41,50.4) v1(41.1,2.4) v1(41.35,20.9) v1(41.55,16.45) v1(41.85,10.25) v1(43.22,66.7) v1(43.22,62) v1(43.5,25.9) v1(44.2,57.3) v1(44.2,52.8) v1(44.2,48.4) v1(45.1,78.5) v1(45.8,2.4) v1(46.25,16.45) v1(46.55,10.25) v1(47.6,29.2) v1(49.8,78.5) v1(50.15,29) v1(50.9,2.4) v1(51.35,16.45) v1(51.65,26.6) v1(51.65,10.25) v1(52.75,23.5) v1(54.9,78.5) v1(55.6,2.4) v1(56.05,16.45) v1(56.25,20.9) v1(56.35,10.25) v1(58.2,45.6) v1(59.6,78.5) v1(61.2,2.4) v1(61.65,16.45) v1(61.95,47.7) v1(61.95,10.25) v1(62.25,21.2) v1(62.55,75.2) v1(64.75,50.8) v1(65.2,78.5) v1(65.9,2.4) v1(66.35,16.45) v1(66.65,10.25) v1(67.65,73.2) v1(67.65,68.1) v1(67.65,63.4) v1(67.75,58.2) v1(67.75,53.5) v1(69.9,78.5) v1(71,2.4) v1(71.45,16.45) v1(71.75,10.25) v1(72.55,67.7) v1(72.55,63) v1(72.65,57.8) v1(72.65,53.1) v1(76.9,67.4) v1(76.9,62.7) v1(76.9,37.8) v1(76.9,33.1) v1(76.9,28) v1(76.9,23.3) v1(76.9,17.7) v1(76.9,13) v1(76.9,8.3) v1(77,57.5) v1(77,52.8) v1(77,47.7) v1(77,43) v1(77.2,2.5) v1(77.3,72.5) v1(77.7,78.4)
GNDD: length 131.4
  Top Layer w0.28: v1(49.54,66.6) C31.2 ; v1(49.54,66.6) 49.54,72.71 48.15,74.1 v1(47.03,74.1) v1(39.41,74.1) v1(31.78,74.1) R25.2 30.17,73.3 TP7.1 ; v1(49.54,66.6) C31.2 ; C31.2 50.04,65.65 ; 50.04,63.65 v1(50.04,64.64) 50.04,65.65 ; v1(54.2,59.7) 54.88,59.7 55.34,59.25 ; 50.04,65.65 v1(50.4,65.65) ; 44.69,38.7 44.69,35.65 45.34,35 ; 44.69,38.7 45,38.7 45.2,38.9 IC1.49 v1(45.87,40.3) v1(47.35,40.3) 47.7,40.3 48.4,41 v1(48.68,41) C5.1 ; 44.69,38.7 44.4,38.7 44.2,38.9 IC1.51 44.2,41.54 46.2,43.54 C6.1 v1(46.2,44.8) ; IC1.31 44.7,28.1 45.2,27.6 48.1,27.6 48.6,28.1 v1(48.6,30.7) 48.3,31 IC1.33 45.6,31 45.2,31.4 45.34,31.54 45.34,35 ; 45.34,35 IC1.41 ; 55.34,59.25 54.54,58.45 v1(52.47,58.45) v1(50.56,58.45) 49.64,58.45 v1(49.64,59.36) ; 55.34,59.25 v1(55.34,58.14)
  Bottom Layer w0.28: v1(54.28,58.45) 54.28,59.61 v1(54.2,59.7) ; v1(54.28,58.45) 54.6,58.14 v1(55.34,58.14) ; v1(54.28,58.45) v1(52.47,58.45) v1(50.56,58.45) ; v1(50.56,58.45) 50.55,58.45 v1(49.64,59.36) 49.64,64.24 v1(50.04,64.64) 50.4,65 v1(50.4,65.65) 50.4,65.74 v1(49.54,66.6) ; v1(50.56,58.45) 50.56,44.8 ; 50.56,44.8 v1(46.2,44.8) ; 50.56,44.8 50.56,42.89 v1(48.68,41) 47.98,40.3 v1(47.35,40.3) v1(45.87,40.3) 45.34,39.78 45.34,31.53 46.18,30.7 v1(48.6,30.7)
  vias: v1(31.8,75.7) v1(31.77,72.5) v1(39.42,75.7) v1(39.39,72.5) v1(44.64,38.3) v1(44.62,36.7) v1(44.61,35.1) v1(44.62,33.7) v1(44.61,32.1) v1(45.7,42.7) v1(46.3,50.42) v1(46.28,48.82) v1(46.27,47.22) v1(46.44,66.7) v1(46.42,65.1) v1(46.41,63.5) v1(46.44,57.9) v1(46.42,56.3) v1(46.41,54.7) v1(47.04,75.7) v1(47.01,72.5) v1(49.7,42.36) v1(49.89,50.42) v1(49.87,48.82) v1(49.86,47.22) v1(50.54,70.3) v1(50.52,68.7) v1(50.51,67.1) v1(51.54,55.6) v1(51.52,54) v1(51.51,52.4) v1(52.15,42.59) v1(52.18,45.79) v1(52.16,44.19) v1(53.62,67.1) v1(53.6,65.5) v1(53.59,63.9) v1(53.57,62.3) v1(53.56,60.7) v1(54.63,72.5) v1(54.66,75.7) v1(54.65,74.1) v1(54.84,50.1) v1(54.82,48.5) v1(54.81,46.9) v1(55.5,67.2) v1(56.53,55.58) v1(56.51,53.98) v1(56.5,52.38) v1(57.5,63.4) v1(57.6,66.6) v1(57.6,65) v1(57.94,50.1) v1(57.92,48.5) v1(58.5,62) v1(58.74,58.45) v1(58.72,56.85) v1(58.75,60.05) v1(60.5,61.5) v1(61.04,68.9) v1(61.02,67.3) v1(61.01,65.7) v1(62.02,55.23) v1(62,53.63) v1(61.99,52.03) v1(62.09,60.77) v1(62.08,59.17) v1(62.06,57.57)
$1N2055: length 19.1
  Top Layer w0.28: R2.2 C21.1 24.8,47.2 34,38 IC1.2
$1N2059: length 18.1
  Top Layer w0.28: IC1.4 31.8,37 24.9,43.9 C20.1 R3.2
$1N2064: length 17.2
  Top Layer w0.28: IC1.6 29.8,36 25.2,40.6 C19.1 R4.2
$1N2069: length 16.2
  Top Layer w0.28: IC1.8 28.1,35 25.8,37.3 C18.1 R5.2
$1N2074: length 15.2
  Top Layer w0.28: IC1.10 C17.1 R6.2
$1N2079: length 16.2
  Top Layer w0.28: IC1.12 28.1,33 25.8,30.7 C16.1 R7.2
$1N2084: length 17.2
  Top Layer w0.28: IC1.14 29.8,32 25.2,27.4 C15.1 R8.2
$1N2089: length 18.1
  Top Layer w0.28: R9.2 C14.1 24.9,24.1 31.8,31 IC1.16
$1N2097: length 86
  Top Layer w0.28: C14.2 v1(21.5,22.7) 20.65,21.85 R10.2 v1(21.59,20.8) v1(22.6,21.81) C14.2 ; C14.2 v1(23.7,22.7) 26.3,22.7 32.8,29.2 IC1.17
  Top Layer w0.5: v1(21.5,26) C15.2 v1(23.7,26) ; v1(21.5,42.5) C20.2 v1(23.7,42.5) ; v1(23.7,35.9) C18.2 v1(21.5,35.9) ; v1(23.7,32.6) C17.2 v1(21.5,32.6) ; v1(23.7,45.8) C21.2 v1(21.5,45.8) ; v1(23.7,39.2) C19.2 v1(21.5,39.2) ; v1(23.7,29.3) C16.2 v1(21.5,29.3)
  Bottom Layer w0.28: v1(23.7,45.8) v1(23.7,42.5) v1(23.7,39.2) v1(23.7,35.9) v1(23.7,32.6) v1(23.7,29.3) v1(23.7,26) v1(23.7,22.7) ; v1(21.5,45.8) v1(21.5,42.5) v1(21.5,39.2) v1(21.5,35.9) v1(21.5,32.6) v1(21.5,29.3) v1(21.5,26) v1(21.5,22.7)
$1N2947: length 57
  Top Layer w0.28: IC3.5 26.89,61.35 25.94,62.3 25.94,63.65 ; IC2.5 49.09,61.35 48.14,62.3 48.14,63.65
  Top Layer w0.6: 47.28,68.22 48.14,67.36 ; 48.14,67.36 C31.1 ; 48.14,67.36 48.14,68.22 ; C31.1 48.14,64.43 ; C31.1 48.14,64.43 ; 48.14,64.43 48.14,63.65 ; 25.94,67.36 26.79,68.22 ; 25.94,67.36 25.08,68.22 ; 25.94,67.36 C32.2 25.94,63.65 ; 25.94,67.36 25.94,68.22
  Top Layer w1: 48.14,68.22 TP5.1 C23.1 C22.1 15.85,70.08 15.85,73.9
$1N3234: length 7.2
  Top Layer w0.28: C26.2 52.04,62.59 ; 52.04,62.59 52.04,64.72 L2.1 ; 52.04,62.59 49.31,62.59 49.09,62.81 49.09,63.65
$1N3242: length 2.4
  Top Layer w0.28: C26.1 50.94,60.05 IC2.6
$1N3333: length 7.2
  Top Layer w0.28: 29.84,62.59 29.84,64.72 L1.1 ; 29.84,62.59 C24.2 ; 29.84,62.59 27.11,62.59 26.89,62.81 26.89,63.65
$1N3336: length 2.4
  Top Layer w0.28: C24.1 28.74,60.05 IC3.6
$1N3595: length 4.1
  Top Layer w0.5: R29.1 R28.2 IC2.4
$1N4010: length 4.1
  Top Layer w0.5: R27.1 R26.2 IC3.4
$1N4304: length 12.4
  Top Layer w0.8: R2.1 13.7,47.2 10.66,44.16 J1.1
$1N4313: length 12.1
  Top Layer w0.8: R3.1 14.3,43.9 12.02,41.62 J1.2
$1N4321: length 11.8
  Top Layer w0.8: J1.3 13.18,39.08 14.7,40.6 R4.1
$1N4328: length 11.5
  Top Layer w0.8: R5.1 15.8,37.3 15.04,36.54 J1.4
$1N4338: length 11.1
  Top Layer w0.8: J1.5 R6.1
$1N4345: length 11.5
  Top Layer w0.8: J1.6 15.04,31.46 15.8,30.7 R7.1
$1N4350: length 11.8
  Top Layer w0.8: J1.7 13.18,28.92 14.7,27.4 R8.1
$1N4357: length 12.1
  Top Layer w0.8: J1.8 12.02,26.38 14.3,24.1 R9.1
$1N4364: length 12.4
  Top Layer w0.8: J1.9 10.66,23.84 13.7,20.8 R10.1
$1N4747: length 5.3
  Top Layer w0.28: IC1.24 C4.1 41.2,24.2 C3.2
$1N5094: length 8.9
  Top Layer w0.28: C11.2 49.6,26.5 49,27.1 44.71,27.1 44.2,27.61 IC1.30
$1N5099: length 7.6
  Top Layer w0.28: IC1.28 43.2,27.91 44.51,26.6 46.9,26.6 47.5,26 C12.1
$1N5104: length 5.5
  Top Layer w0.28: IC1.26 42.2,28.2 C13.2
$1N5770: length 12.8
  Top Layer w0.28: R12.1 55.7,44.1 49.6,38 IC1.47
$1N5774: length 12.3
  Top Layer w0.28: R13.1 55.7,42.5 50.7,37.5 IC1.46
$1N5779: length 11.9
  Top Layer w0.28: IC1.45 51.8,37 55.7,40.9 R14.1
$1N5784: length 11.4
  Top Layer w0.28: R15.1 55.7,39.3 52.9,36.5 IC1.44
$1N5789: length 11
  Top Layer w0.28: R16.1 57.24,37.69 55.69,37.69 54,36 IC1.43
$1N5794: length 10.5
  Top Layer w0.28: IC1.42 55.1,35.5 55.6,36 57.15,36 R17.1
$1N5799: length 10.2
  Top Layer w0.28: IC1.40 R18.1
$1N5804: length 10.7
  Top Layer w0.28: R19.1 56.3,32.9 55.2,34 IC1.39
$1N5809: length 11.2
  Top Layer w0.28: IC1.38 54.1,33.5 56.3,31.3 R20.1
$1N5814: length 11.6
  Top Layer w0.28: R21.1 56.3,29.7 53,33 IC1.37
$1N5819: length 12.1
  Top Layer w0.28: IC1.36 51.9,32.5 56.3,28.1 R22.1
$1N5824: length 12.5
  Top Layer w0.28: IC1.35 50.8,32 56.3,26.5 R23.1
$1N5829: length 13
  Top Layer w0.28: R24.1 56.3,24.9 49.7,31.5 IC1.34
$1N6093: length 15.2
  Top Layer w0.28: R24.2 61.6,24.9 67.24,19.26 J2.13
$1N6097: length 14.8
  Top Layer w0.28: J2.12 67,21.8 62.3,26.5 R23.2
$1N6102: length 14.4
  Top Layer w0.28: J2.11 66.76,24.34 63,28.1 R22.2
$1N6107: length 14
  Top Layer w0.28: R21.2 63.7,29.7 66.52,26.88 J2.10
$1N6112: length 13.6
  Top Layer w0.28: R20.2 64.6,31.3 66.48,29.42 J2.9
$1N6117: length 13.2
  Top Layer w0.28: R19.2 65.5,32.9 66.44,31.96 J2.8
$1N6122: length 12.8
  Top Layer w0.28: R18.2 J2.7
$1N6127: length 13.2
  Top Layer w0.28: R17.2 65.5,36.1 66.44,37.04 J2.6
$1N6137: length 13.6
  Top Layer w0.28: R16.2 64.6,37.7 66.48,39.58 J2.5
$1N6143: length 14
  Top Layer w0.28: J2.4 66.52,42.12 63.7,39.3 R15.2
$1N6150: length 14.4
  Top Layer w0.28: J2.3 66.76,44.66 63,40.9 R14.2
$1N6157: length 14.8
  Top Layer w0.28: R13.2 62.3,42.5 67,47.2 J2.2
$1N6164: length 15.2
  Top Layer w0.28: J2.1 67.24,49.74 61.6,44.1 R12.2
$1N6494: length 6.6
  Top Layer w0.28: 42.2,46.9 IC1.55
$1N9345: length 3.1
  Top Layer w0.28: TP1.1 37.69,41.8 38.2,41.29 IC1.63
$1N9349: length 4.5
  Top Layer w0.28: TP2.1 38,42.6 39.2,41.4 IC1.61

## Copper pours and planes (outline as drawn; the poured copper is in the pictures)
+3V on Top Layer: 54.23,66.49 57,66.49 57,60.4 54.23,60.4
+5V on Top Layer: 32.03,66.49 34.8,66.49 34.8,60.4 32.03,60.4
GND on Top Layer: 0,80 80,80 80,0 0,0
GND on Bottom Layer: 0,80 80,80 80,0 0,0
GNDD on Top Layer: 29.4,76.96 29.4,71.3 43.4,71.3 45.11,69.59 45.11,43.54 43.6,42.03 43.6,30.6 43.9,30.3 49,30.3 49.2,30.5 49.2,31 49,31.2 46.21,31.2 45.91,31.5 45.91,38.01 46.2,38.3 49.2,38.3 62.9,52 62.9,70.1 56.04,76.96
GNDD on Bottom Layer: 29.4,76.96 62.9,76.96 62.9,30.3 29.4,30.3
$1N2097 on Top Layer: 20.21,23.09 24.47,23.09 24.47,19.97 20.21,19.97
$1N2097 on Bottom Layer: 20.65,47.2 24.47,47.2 24.47,19.92 20.65,19.92
$1N3234 on Top Layer: 48.66,66.48 53,66.48 53,61.03 48.66,61.03
$1N3242 on Top Layer: 49.7,61.5 52.74,61.5 52.74,59.5 49.7,59.5
$1N3333 on Top Layer: 26.46,66.48 30.8,66.48 30.8,61.03 26.46,61.03
$1N3336 on Top Layer: 27.5,61.5 30.54,61.5 30.54,59.5 27.5,59.5

## Text on the board
Top Silkscreen Layer: 负 | 正 | GND | GNDD | 5V | 3V | 2024.08.07
